# Altium schematic sheet crossbar.SchDoc: CrossBar AD/DA
size A4; CompanyName: NTNU; DrawnBy: Gunnar Tufte; ProjectName: NASCENCE
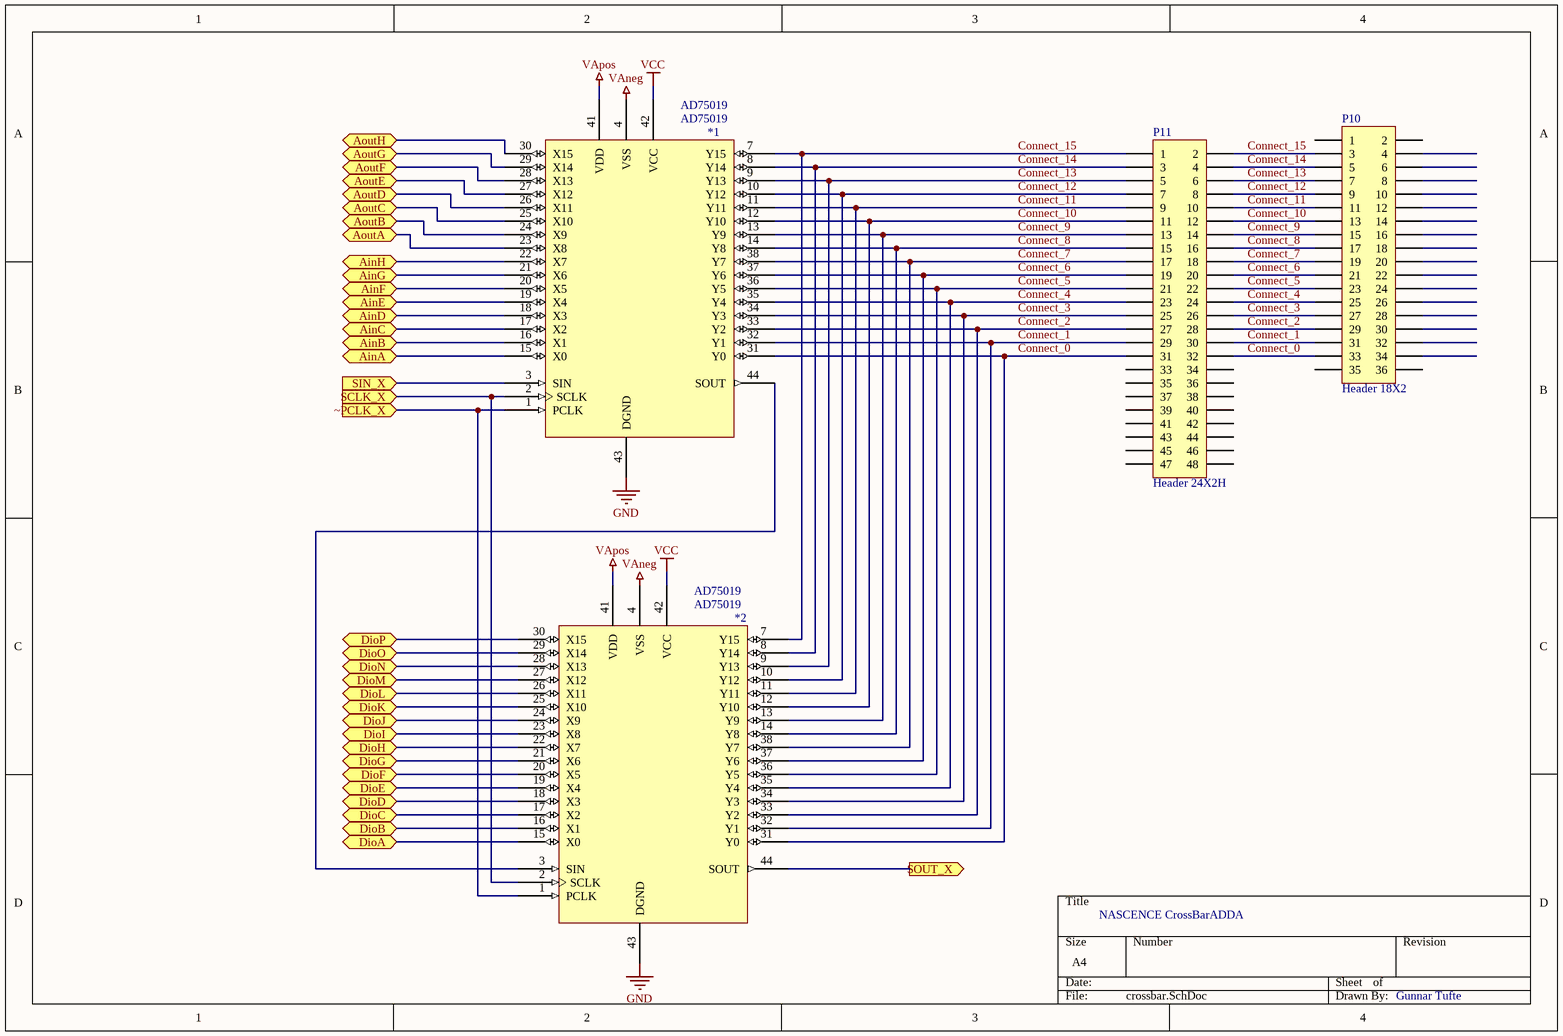
[diagram p0: crossbar.SchDoc]

## Parts
*1  AD75019  [PLCC-44AL]
*2  AD75019  [PLCC-44AL]
P10  Header 18X2  [HDR2X18]
P11  Header 24X2H  [HDR2X24H]

## Ports
AinA, AinB, AinC, AinD, AinE, AinF, AinG, AinH, AoutA, AoutB, AoutC, AoutD, AoutE, AoutF, AoutG, AoutH, DioA, DioB, DioC, DioD, DioE, DioF, DioG, DioH, DioI, DioJ, DioK, DioL, DioM, DioN, DioO, DioP, SCLK_X (in), SIN_X (in), SOUT_X (out), ~PCLK_X (in)

## Nets
GND: *1.43(DGND) *2.43(DGND)
VAneg: *1.4(VSS) *2.4(VSS)
VApos: *1.41(VDD) *2.41(VDD)
VCC: *1.42(VCC) *2.42(VCC)
AinA: *1.15(X0) ; port AinA
AinB: *1.16(X1) ; port AinB
AinC: *1.17(X2) ; port AinC
AinD: *1.18(X3) ; port AinD
AinE: *1.19(X4) ; port AinE
AinF: *1.20(X5) ; port AinF
AinG: *1.21(X6) ; port AinG
AinH: *1.22(X7) ; port AinH
AoutA: *1.23(X8) ; port AoutA
AoutB: *1.24(X9) ; port AoutB
AoutC: *1.25(X10) ; port AoutC
AoutD: *1.26(X11) ; port AoutD
AoutE: *1.27(X12) ; port AoutE
AoutF: *1.28(X13) ; port AoutF
AoutG: *1.29(X14) ; port AoutG
AoutH: *1.30(X15) ; port AoutH
Connect_0: *1.31(Y0) *2.31(Y0) P10.33 P11.31 P11.32
Connect_1: *1.32(Y1) *2.32(Y1) P10.31 P11.29 P11.30
Connect_2: *1.33(Y2) *2.33(Y2) P10.29 P11.27 P11.28
Connect_3: *1.34(Y3) *2.34(Y3) P10.27 P11.25 P11.26
Connect_4: *1.35(Y4) *2.35(Y4) P10.25 P11.23 P11.24
Connect_5: *1.36(Y5) *2.36(Y5) P10.23 P11.21 P11.22
Connect_6: *1.37(Y6) *2.37(Y6) P10.21 P11.19 P11.20
Connect_7: *1.38(Y7) *2.38(Y7) P10.19 P11.17 P11.18
Connect_8: *1.14(Y8) *2.14(Y8) P10.17 P11.15 P11.16
Connect_9: *1.13(Y9) *2.13(Y9) P10.15 P11.13 P11.14
Connect_10: *1.12(Y10) *2.12(Y10) P10.13 P11.11 P11.12
Connect_11: *1.11(Y11) *2.11(Y11) P10.11 P11.9 P11.10
Connect_12: *1.10(Y12) *2.10(Y12) P10.9 P11.7 P11.8
Connect_13: *1.9(Y13) *2.9(Y13) P10.7 P11.5 P11.6
Connect_14: *1.8(Y14) *2.8(Y14) P10.5 P11.3 P11.4
Connect_15: *1.7(Y15) *2.7(Y15) P10.3 P11.1 P11.2
DioA: *2.15(X0) ; port DioA
DioB: *2.16(X1) ; port DioB
DioC: *2.17(X2) ; port DioC
DioD: *2.18(X3) ; port DioD
DioE: *2.19(X4) ; port DioE
DioF: *2.20(X5) ; port DioF
DioG: *2.21(X6) ; port DioG
DioH: *2.22(X7) ; port DioH
DioI: *2.23(X8) ; port DioI
DioJ: *2.24(X9) ; port DioJ
DioK: *2.25(X10) ; port DioK
DioL: *2.26(X11) ; port DioL
DioM: *2.27(X12) ; port DioM
DioN: *2.28(X13) ; port DioN
DioO: *2.29(X14) ; port DioO
DioP: *2.30(X15) ; port DioP
SCLK_X: *1.2(SCLK) *2.2(SCLK) ; port SCLK_X
SIN_X: *1.3(SIN) ; port SIN_X
SOUT_X: *2.44(SOUT) ; port SOUT_X
~PCLK_X: *1.1(PCLK) *2.1(PCLK) ; port ~PCLK_X
Net*1_44: *1.44(SOUT) *2.3(SIN)

Not connected (* = marked no-connect by the designer): *1 5(NC1) 6(NC2) 39(NC3) 40(NC4); *2 5(NC1) 6(NC2) 39(NC3) 40(NC4); P10 1 2 4 6 8 10 12 14 16 18 20 22 24 26 28 30 32 34 35 36; P11 33 34 35 36 37 38 39 40 41 42 43 44 45 46 47 48

## Notes on the sheet
- NASCENCE CrossBarADDA
- Gunnar Tufte

## Library data of the parts
*1 *2 = Component_1: crosspoint 16x16
P10 = Header 18X2: Header, 18-Pin, Dual row; LatestRevisionDate: 17-Jul-2002; LatestRevisionNote: Re-released for DXP Platform.; Publisher: Altium Limited
P11 = Header 24X2H: Header, 24-Pin, Dual row, Right Angle; LatestRevisionDate: 17-Jul-2002; LatestRevisionNote: Re-released for DXP Platform.; Publisher: Altium Limited